# Altium schematic sheet Power.SchDoc: Tápellátás
size A4; Author: Debreczeni László; Organization: BME-AUT; DocumentNumber: 3; Revision: A27; SheetNumber: 3; SheetTotal: 5
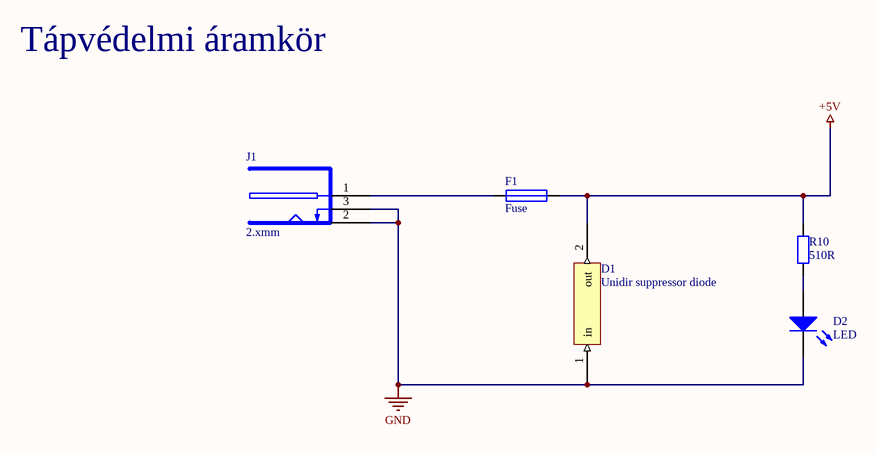
[diagram p0: Power.SchDoc]

## Parts
D1  Unidir suppressor diode  [DIOM4426X23M]
D2  LED  [FP_0805_LED_RED]
F1  Fuse  [FP_MULTIFUSE]
J1  2.xmm  [FP_DC_TAP_ANYA]
R10  510R  [FP_1206_RES]

## Nets
+5V: D1.2(out) F1.2 R10.2
GND: D1.1(in) D2.2(K) J1.2(SLEEVE) J1.3(BREAK)
NetD2_1: D2.1(A) R10.1
NetF1_1: F1.1 J1.1(PIN)

## Notes on the sheet
- Tápvédelmi áramkör
- Title
- Size:
- Date:
- A4
- Number:
- Time:
- Revision:
- Sheet
- of
- File:

## Library data of the parts
D1 = Suppressor diode: Suppressor diode for transients; Supplier: Lomex; Reference: 96-03-85; Name: Suppressor diode
D2 = LED: Typical RED GaAs LED; pin to pad: 1>A 2>K; U_fw: 5 V; I_max: 30 mA; Name: Green LED; Supplier: Lomex; Reference: 95-02-77
F1 = Fuse: Name: SMD Fuse; Reference: 44-04-71; Supplier: Lomex
J1 = DC_TAP_ANYA: 2.xmm DC HEBA25 TÁPFESZÜLTSÉG ALJZAT ZÁRT, NYÁKBA 90°; Name: TÁP DC ANYA 5.5/2.1/9.5mm DCS-5521-5; Supplier: Lomex; Reference: 43-07-67
R10 = RES: Resistor; Tolerance: 5%; Power: 0.25W; Name: 1206 Resistor; Supplier: Lomex; Reference: 81-12-04; Value: 510R